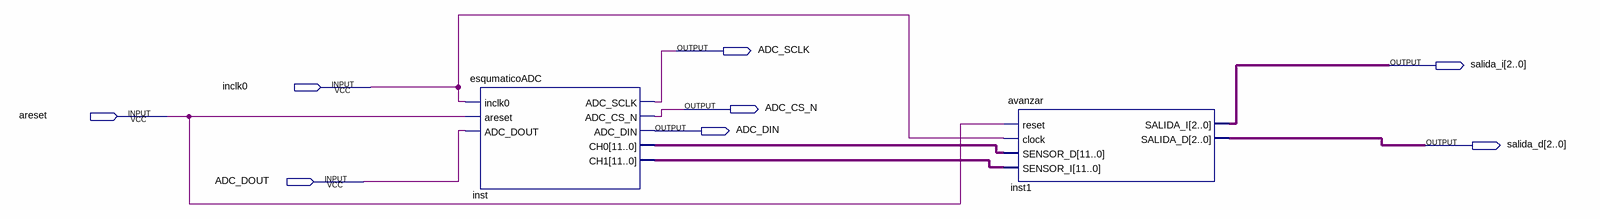
[diagram p0: schematic sheet]
// Quartus schematic adc_avanzar.bdf as structural Verilog: 2 symbols, 8 pins
module adc_avanzar (
  input  inclk0,
  input  areset,
  input  ADC_DOUT,
  output ADC_SCLK,
  output [2:0] salida_i,
  output ADC_CS_N,
  output ADC_DIN,
  output [2:0] salida_d
);

  wire [11:0] inst_ch0, inst_ch1;

  esqumaticoADC inst (
    .inclk0(inclk0), .areset(areset), .ADC_DOUT(ADC_DOUT), .ADC_SCLK(ADC_SCLK), .ADC_CS_N(ADC_CS_N),
    .ADC_DIN(ADC_DIN), .CH0(inst_ch0), .CH1(inst_ch1));
  avanzar inst1 (
    .reset(areset), .clock(inclk0), .SENSOR_D(inst_ch0), .SENSOR_I(inst_ch1), .SALIDA_I(salida_i),
    .SALIDA_D(salida_d));
endmodule
